# Altium schematic sheet SX1262_Radio.SchDoc
size A4; SheetNumber: 7; SheetTotal: 7
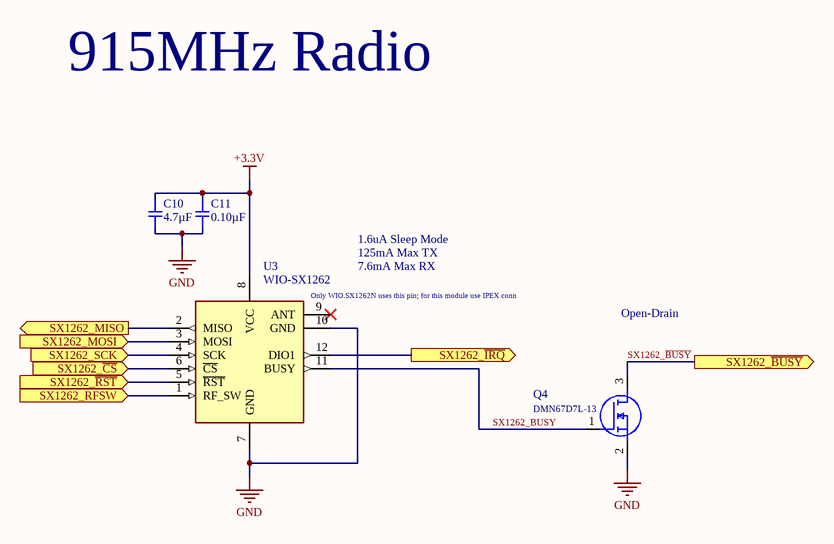
[diagram p0: SX1262_Radio.SchDoc]

## Parts
C10  4.7µF  [SMD-0402C]
C11  0.10µF  [SMD-0402C]
Q4  DMN67D7L-13  [DMN67D7L13]
U3  WIO-SX1262  [114993390]

## Ports
SX1262_MISO (out), SX1262_MOSI (in), SX1262_RFSW (in), SX1262_SCK (in), SX1262_~{BUSY} (out), SX1262_~{CS} (in), SX1262_~{IRQ} (out), SX1262_~{RST} (in)

## Nets
+3.3V: C10.1 C11.1 U3.8(VCC)
GND: C10.2 C11.2 Q4.2(S) U3.7(GND) U3.10(GND)
SX1262_~{BUSY}: Q4.3(D) ; port SX1262_~{BUSY}
SX1262_BUSY: Q4.1(G) U3.11(BUSY)
SX1262_~{CS}: U3.6(~{CS}) ; port SX1262_~{CS}
SX1262_~{IRQ}: U3.12(DIO1) ; port SX1262_~{IRQ}
SX1262_MISO: U3.2(MISO) ; port SX1262_MISO
SX1262_MOSI: U3.3(MOSI) ; port SX1262_MOSI
SX1262_~{RST}: U3.5(~{RST}) ; port SX1262_~{RST}
SX1262_RFSW: U3.1(RF_SW) ; port SX1262_RFSW
SX1262_SCK: U3.4(SCK) ; port SX1262_SCK

Not connected (* = marked no-connect by the designer): U3 9(ANT)*

## Notes on the sheet
- 915MHz Radio
- 1.6uA Sleep Mode
- 125mA Max TX
- 7.6mA Max RX
- (near U3) Only WIO.SX1262N uses this pin; for this module use IPEX conn
- Open-Drain

## Library data of the parts
C10 = GRM153R60J475ME15D: CAP CER 4.7UF 6.3V X5R 0402; Manufacturer: Murata Electronics North America; Factory Stock: 0; Unit Price (USD): 0.27; Minimum Quantity: 1; Tolerance: ±20%; Datasheets: http://psearch.en.murata.com/capacitor/product/GRM153R60J475ME15%23.pdf; Image: //media.digikey.com/Renders/Murata%20Renders/ZRB-SERIES-0402.jpg; Digi-Key Part Number: 490-13232-1-ND; Part Number: GRM153R60J475ME15D; Quantity Available: 30412; @ qty: 0; Packaging: Cut Tape (CT); Series: GRM; Part Status: Active; Value: 4.7µF; Voltage: 6.3V; Temperature Coefficient: X5R; Operating Temperature: -55°C ~ 85°C; Features: Derating Recommended; Ratings: -; Applications: General Purpose; Mounting Type: Surface Mount, MLCC; Package / Case: 0402 (1005 Metric); Size / Dimension: 0.039" L x 0.020" W (1.00mm x 0.50mm); Height - Seated (Max): -; Thickness (Max): 0.013" (0.33mm); Lead Spacing: -; Lead Style: -
C11 = GCM155R71C104KA55D: CAP CER 0.1UF 16V X7R 0402; Manufacturer: Murata Electronics North America; Factory Stock: 0; Unit Price (USD): 0.1; Minimum Quantity: 1; Tolerance: ±10%; Datasheets: http://www.murata.com/~/media/webrenewal/support/library/catalog/products/capacitor/mlcc/c03e.ashx; Image: //media.digikey.com/Renders/Murata%20Renders/ZRB-SERIES-0402.jpg; Digi-Key Part Number: 490-4759-1-ND; Part Number: GCM155R71C104KA55D; Quantity Available: 734194; @ qty: 0; Packaging: Cut Tape (CT); Series: GCM; Part Status: Active; Value: 0.10µF; Voltage: 16V; Temperature Coefficient: X7R; Operating Temperature: -55°C ~ 125°C; Features: -; Ratings: AEC-Q200; Applications: Automotive; Mounting Type: Surface Mount, MLCC; Package / Case: 0402 (1005 Metric); Size / Dimension: 0.039" L x 0.020" W (1.00mm x 0.50mm); Height - Seated (Max): -; Thickness (Max): 0.022" (0.55mm); Lead Spacing: -; Lead Style: -
Q4 = DMN67D7L-13: MOSFET (N-Channel); Manufacturer_Name: Diodes Incorporated; Datasheet Link: https://www.diodes.com/assets/Package-Files/SOT23.pdf; Height: 1.1mm; Manufacturer_Part_Number: DMN67D7L-13; Mouser Part Number: 621-DMN67D7L-13; Mouser Price/Stock: https://www.mouser.co.uk/ProductDetail/Diodes-Incorporated/DMN67D7L-13?qs=W0yvOO0ixfHR5TrLcSFuNw%3D%3D; Arrow Part Number: DMN67D7L-13; Arrow Price/Stock: https://www.arrow.com/en/products/dmn67d7l-13/diodes-incorporated?region=nac; Value: DMN67D7L-13
U3 = WIO-SX1262: RF Modules Wio-SX1262 Wireless Module (Bulk), SX1262 embedded, supports LoRa&LoRaWAN on EU868 & US915; Manufacturer_Name: Seeed Studio; Datasheet Link: https://www.mouser.com/pdfDocs/Wio-SX1262module-Datasheet.pdf; Height: 3.15mm; Manufacturer_Part_Number: 114993390; Mouser Part Number: 713-114993390; Mouser Price/Stock: https://www.mouser.co.uk/ProductDetail/Seeed-Studio/114993390?qs=NeOn4crkEuu9JWV37oJsXg%3D%3D; Value: WIO-SX1262